# EAGLE design 10S (EAGLE 7.6.0)

## Sheet 1 of 2
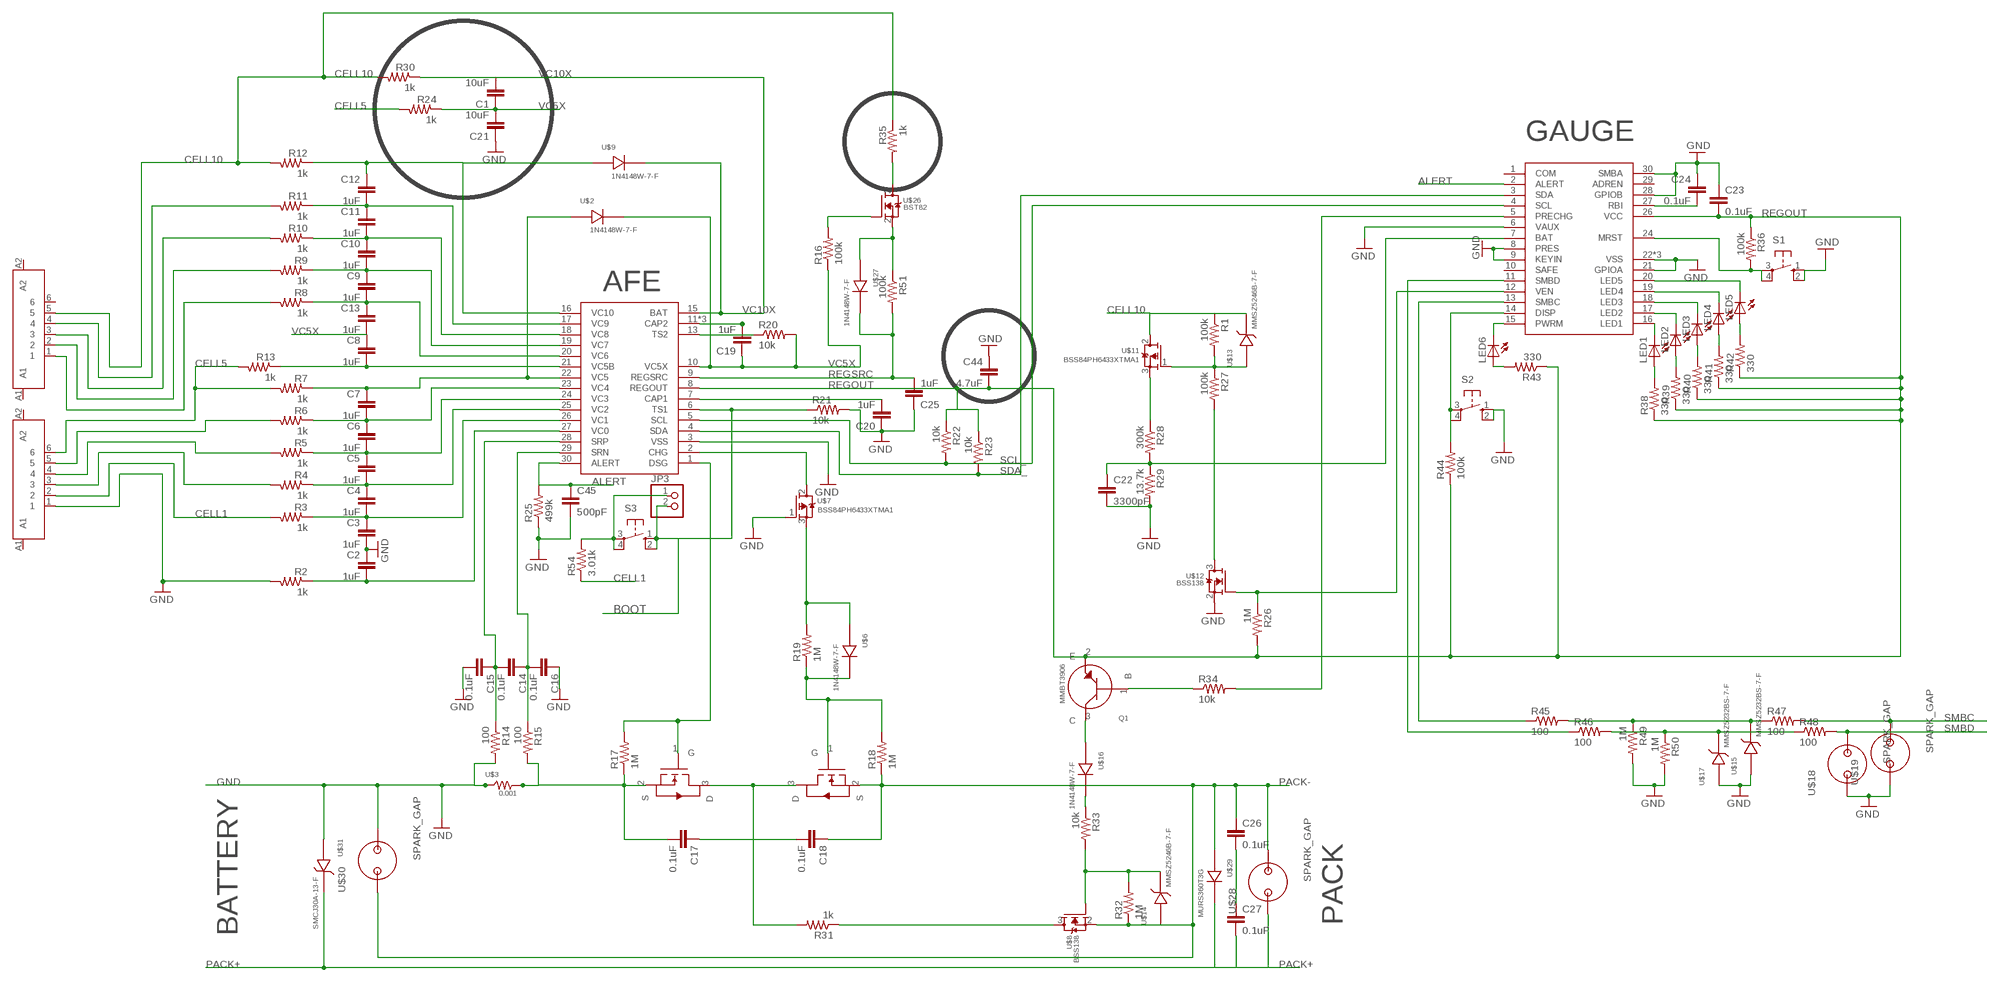
[diagram p0: schematic, sheet 1]

### Parts
C1  10uF  C-EUC1210  [C1210]
C2  1uF  C-EUC0805  [C0805]
C3  1uF  C-EUC0805  [C0805]
C4  1uF  C-EUC0805  [C0805]
C5  1uF  C-EUC0805  [C0805]
C6  1uF  C-EUC0805  [C0805]
C7  1uF  C-EUC0805  [C0805]
C8  1uF  C-EUC0805  [C0805]
C9  1uF  C-EUC0805  [C0805]
C10  1uF  C-EUC0805  [C0805]
C11  1uF  C-EUC0805  [C0805]
C12  1uF  C-EUC0805  [C0805]
C13  1uF  C-EUC0805  [C0805]
C14  0.1uF  C-EUC0805  [C0805]
C15  0.1uF  C-EUC0805  [C0805]
C16  0.1uF  C-EUC0805  [C0805]
C17  0.1uF  C-EUC0805  [C0805]
C18  0.1uF  C-EUC0805  [C0805]
C19  1uF  C-EUC0805  [C0805]
C20  1uF  C-EUC0805  [C0805]
C21  10uF  C-EUC1210  [C1210]
C22  3300pF  C-EUC0402  [C0402]
C23  0.1uF  C-EUC0805  [C0805]
C24  0.1uF  C-EUC0805  [C0805]
C25  1uF  C-EUC0805  [C0805]
C26  0.1uF  C-EUC0805  [C0805]
C27  0.1uF  C-EUC0805  [C0805]
C44  4.7uF  C-EUC0805  [C0805]
C45  500pF  C-EUC0603  [C0603]
JP3  PINHD-1X2  [1X02]
LED1  LEDCHIPLED_0603  [CHIPLED_0603]
LED2  LEDCHIPLED_0603  [CHIPLED_0603]
LED3  LEDCHIPLED_0603  [CHIPLED_0603]
LED4  LEDCHIPLED_0603  [CHIPLED_0603]
LED5  LEDCHIPLED_0603  [CHIPLED_0603]
LED6  LEDCHIPLED_0603  [CHIPLED_0603]
Q1  MMBT3906  [SOT23-3]
R1  100k  R-US_R0805  [R0805]
R2  1k  R-US_R1206  [R1206]
R3  1k  R-US_R1206  [R1206]
R4  1k  R-US_R1206  [R1206]
R5  1k  R-US_R1206  [R1206]
R6  1k  R-US_R1206  [R1206]
R7  1k  R-US_R1206  [R1206]
R8  1k  R-US_R1206  [R1206]
R9  1k  R-US_R1206  [R1206]
R10  1k  R-US_R1206  [R1206]
R11  1k  R-US_R1206  [R1206]
R12  1k  R-US_R1206  [R1206]
R13  1k  R-US_R1206  [R1206]
R14  100  R-US_R0805  [R0805]
R15  100  R-US_R0805  [R0805]
R16  100k  R-US_R0805  [R0805]
R17  1M  R-US_R1206  [R1206]
R18  1M  R-US_R1206  [R1206]
R19  1M  R-US_R1206  [R1206]
R20  10k  R-US_R0805  [R0805]
R21  10k  R-US_R0805  [R0805]
R22  10k  R-US_R0805  [R0805]
R23  10k  R-US_R0805  [R0805]
R24  1k  R-US_R1206  [R1206]
R25  499k  R-US_R0603  [R0603]
R26  1M  R-US_R1206  [R1206]
R27  100k  R-US_R0805  [R0805]
R28  300k  R-US_R0805  [R0805]
R29  13.7k  R-US_R0805  [R0805]
R30  1k  R-US_R1206  [R1206]
R31  1k  R-US_R2512  [R2512]
R32  1M  R-US_R1206  [R1206]
R33  10k  R-US_R0805  [R0805]
R34  10k  R-US_R0805  [R0805]
R35  1k  R-US_R1206  [R1206]
R36  100k  R-US_R0805  [R0805]
R38  330  R-US_R0402  [R0402]
R39  330  R-US_R0402  [R0402]
R40  330  R-US_R0402  [R0402]
R41  330  R-US_R0402  [R0402]
R42  330  R-US_R0402  [R0402]
R43  330  R-US_R0402  [R0402]
R44  100k  R-US_R0402  [R0402]
R45  100  R-US_R0805  [R0805]
R46  100  R-US_R0805  [R0805]
R47  100  R-US_R0805  [R0805]
R48  100  R-US_R0805  [R0805]
R49  1M  R-US_R1206  [R1206]
R50  1M  R-US_R1206  [R1206]
R51  100k  R-US_R0805  [R0805]
R54  3.01k  R-US_R1206  [R1206]
S1  10-XX  [B3F-10XX]
S2  10-XX  [B3F-10XX]
S3  10-XX  [B3F-10XX]
U$1  BQ76930  [SOIC-30]
U$2  1N4148W-7-F  [SOD-123]
U$3  0.001  ERJ-MS6SFM50U  [ERJ-MS6SFM50U]
U$4  AOB290L  [TO-263]
U$5  AOB290L  [TO-263]
U$6  1N4148W-7-F  [SOD-123]
U$7  BSS84PH6433XTMA1  [SOT23-3]
U$8  BSS138  [SOT23-3]
U$9  1N4148W-7-F  [SOD-123]
U$10  BQ78350-R1  [SOIC-30]
U$11  BSS84PH6433XTMA1  [SOT23-3]
U$12  BSS138  [SOT23-3]
U$13  MMSZ5246B-7-F  [SOD-123]
U$14  MMSZ5246B-7-F  [SOD-123]
U$15  MMSZ5232BS-7-F  [SOD-323F]
U$16  1N4148W-7-F  [SOD-123]
U$17  MMSZ5232BS-7-F  [SOD-323F]
U$18  SPARK_GAP  [SPARK_GAP]
U$19  SPARK_GAP  [SPARK_GAP]
U$24  JST_6PIN  [JST_6PIN]
U$26  BST82  [SOT23-3]
U$27  1N4148W-7-F  [SOD-123]
U$28  SPARK_GAP  [SPARK_GAP]
U$29  MURS360T3G  [SMC(DO-214AB)]
U$30  SPARK_GAP  [SPARK_GAP]
U$31  SMCJ30A-13-F  [SMB(DO-214AA)]
U$33  JST_6PIN  [JST_6PIN]

### Nets
ALERT: C45.1 R25.2 U$1.30(ALERT) U$10.2(ALERT)
BOOT: JP3.2 R21.1 S3.1(S) S3.2(S1) U$1.6(TS1)
CELL1: R3.2 R54.1 U$33.2
CELL5: R7.2 R13.2 R24.2 U$33.6
CELL10: R1.1 R12.2 R30.2 R35.1 U$11.2(S) U$13.P$2 U$24.5
GND: C2.1 C3.2 C15.2 C16.1 C20.1 C21.1 C22.2 C23.1 C24.1 C25.1 C44.1 C45.2 R2.2 R14.2 R21.2 R25.1 R29.2 R49.2 R50.2 S1.1(S) S1.2(S1) S2.1(S) S2.2(S1) U$1.3(VSS) U$3.1 U$7.1(G) U$10.6(VAUX) U$10.8(PRES) U$10.9(KEYIN) U$10.21(GPIOA) U$10.22(VSS) U$10.23(VSS) U$10.25(VSS) U$10.28(GPIOB) U$10.30(SMBA) U$12.2(S) U$15.1 U$17.1 U$18.P$1 U$19.P$1 U$30.P$2 U$31.P$1 U$33.1 ; also sheet 2
N$1: C3.1 C4.2 R3.1 U$1.26(VC1)
N$2: C4.1 C5.2 R4.1 U$1.25(VC2)
N$3: C5.1 C6.2 R5.1 U$1.24(VC3)
N$4: C6.1 C7.2 R6.1 U$1.23(VC4)
N$5: C7.1 R7.1 U$1.22(VC5) U$2.P$1
N$6: C8.2 R13.1 U$1.21(VC5B)
N$7: C9.1 C10.2 R9.1 U$1.19(VC7)
N$8: C10.1 C11.2 R10.1 U$1.18(VC8)
N$9: C11.1 C12.2 R11.1 U$1.17(VC9)
N$10: C12.1 R12.1 U$1.16(VC10) U$9.P$1
N$11: R5.2 U$33.4
N$12: C2.2 R2.1 U$1.27(VC0)
N$14: C26.2 C27.1
N$15: R4.2 U$33.3
N$16: R6.2 U$33.5
N$18: R8.2 U$24.1
N$19: R9.2 U$24.2
N$20: R10.2 U$24.3
N$21: R11.2 U$24.4
N$22: R31.1 U$8.3(D)
N$23: C9.2 C13.1 R8.1 U$1.20(VC6)
N$24: R16.2 U$26.1(G)
N$25: C20.2 U$1.7(CAP1)
N$26: C14.1 C16.2 R15.1 U$1.29(SRN)
N$27: JP3.1 R54.2 S3.3(P) S3.4(P1)
N$28: C14.2 C15.1 R14.1 U$1.28(SRP)
N$29: C17.2 R15.2 R17.1 U$3.2 U$4.2(S)
N$31: R31.2 U$4.3(D) U$5.3(D)
N$32: R18.2 R19.1 U$5.1(G) U$6.P$2
N$33: R19.2 U$6.P$1 U$7.3(D)
N$34: U$1.2(CHG) U$7.2(S)
N$35: C17.1 C18.2
N$37: C19.2 U$1.11(CAP2) U$1.12(CAP2) U$1.14(CAP2)
N$38: R20.1 U$1.13(TS2)
N$40: R26.1 U$10.12(VEN) U$12.1(G)
N$41: R27.2 U$12.3(D)
N$43: R1.2 R27.1 U$11.1(G) U$13.P$1
N$44: R28.1 U$11.3(D)
N$45: C22.1 R28.2 R29.1 U$10.7(BAT)
N$46: R32.2 R33.2 U$8.1(G) U$14.P$2
N$47: Q1.3(C) U$16.P$1
N$48: R33.1 U$16.P$2
N$49: Q1.1(B) R34.1
N$50: C24.2 U$10.27(RBI)
N$51: R36.2 S1.3(P) S1.4(P1) U$10.24(MRST)
N$52: LED1.A R38.2
N$53: LED2.A R39.2
N$54: LED3.A R40.2
N$55: LED4.A R41.2
N$56: LED5.A R42.2
N$57: LED1.C U$10.16(LED1)
N$58: LED2.C U$10.17(LED2)
N$59: LED3.C U$10.18(LED3)
N$60: LED4.C U$10.19(LED4)
N$61: LED5.C U$10.20(LED5)
N$62: LED6.A R43.2
N$63: R44.2 S2.3(P) S2.4(P1) U$10.14(DISP)
N$64: LED6.C U$10.15(PWRM)
N$65: R34.2 U$10.5(PRECHG)
N$66: R46.1 U$10.11(SMBD)
N$67: R45.1 U$10.13(SMBC)
N$68: R45.2 R47.1 R49.1 U$15.2
N$69: R46.2 R48.1 R50.1 U$17.2
N$70: R51.1 U$26.2(S) U$27.P$1
N$72: R35.2 U$26.3(D)
N$73: R17.2 U$1.1(DSG) U$4.1(G)
PACK+: C27.2 U$28.P$1 U$29.2 U$31.P$2
PACK-: C18.1 C26.1 R18.1 R32.1 U$5.2(S) U$8.2(S) U$14.P$1 U$28.P$2 U$29.1 U$30.P$1
REGOUT: C23.2 C44.2 Q1.2(E) R22.1 R23.1 R26.2 R36.1 R38.1 R39.1 R40.1 R41.1 R42.1 R43.1 R44.1 U$1.8(REGOUT) U$10.26(VCC) ; also sheet 2
REGSRC: C25.2 R51.2 U$1.9(REGSRC) U$27.P$2
SCL_: R22.2 U$1.5(SCL) U$10.4(SCL)
SDA_: R23.2 U$1.4(SDA) U$10.3(SDA)
SMBC: R47.2 U$19.P$2 ; also sheet 2
SMBD: R48.2 U$18.P$2 ; also sheet 2
VC5X: C1.1 C8.1 C13.2 C19.1 C21.2 R16.1 R20.2 R24.1 U$1.10(VC5X) U$2.P$2
VC10X: C1.2 R30.1 U$1.15(BAT) U$9.P$2
Unconnected: U$10.1(COM) U$10.10(SAFE) U$10.29(ADREN) U$24.6 U$24.A1 U$24.A2 U$33.A1 U$33.A2

### Notes on the sheet
- GAUGE
- AFE
- PACK
- BATTERY

## Sheet 2 of 2
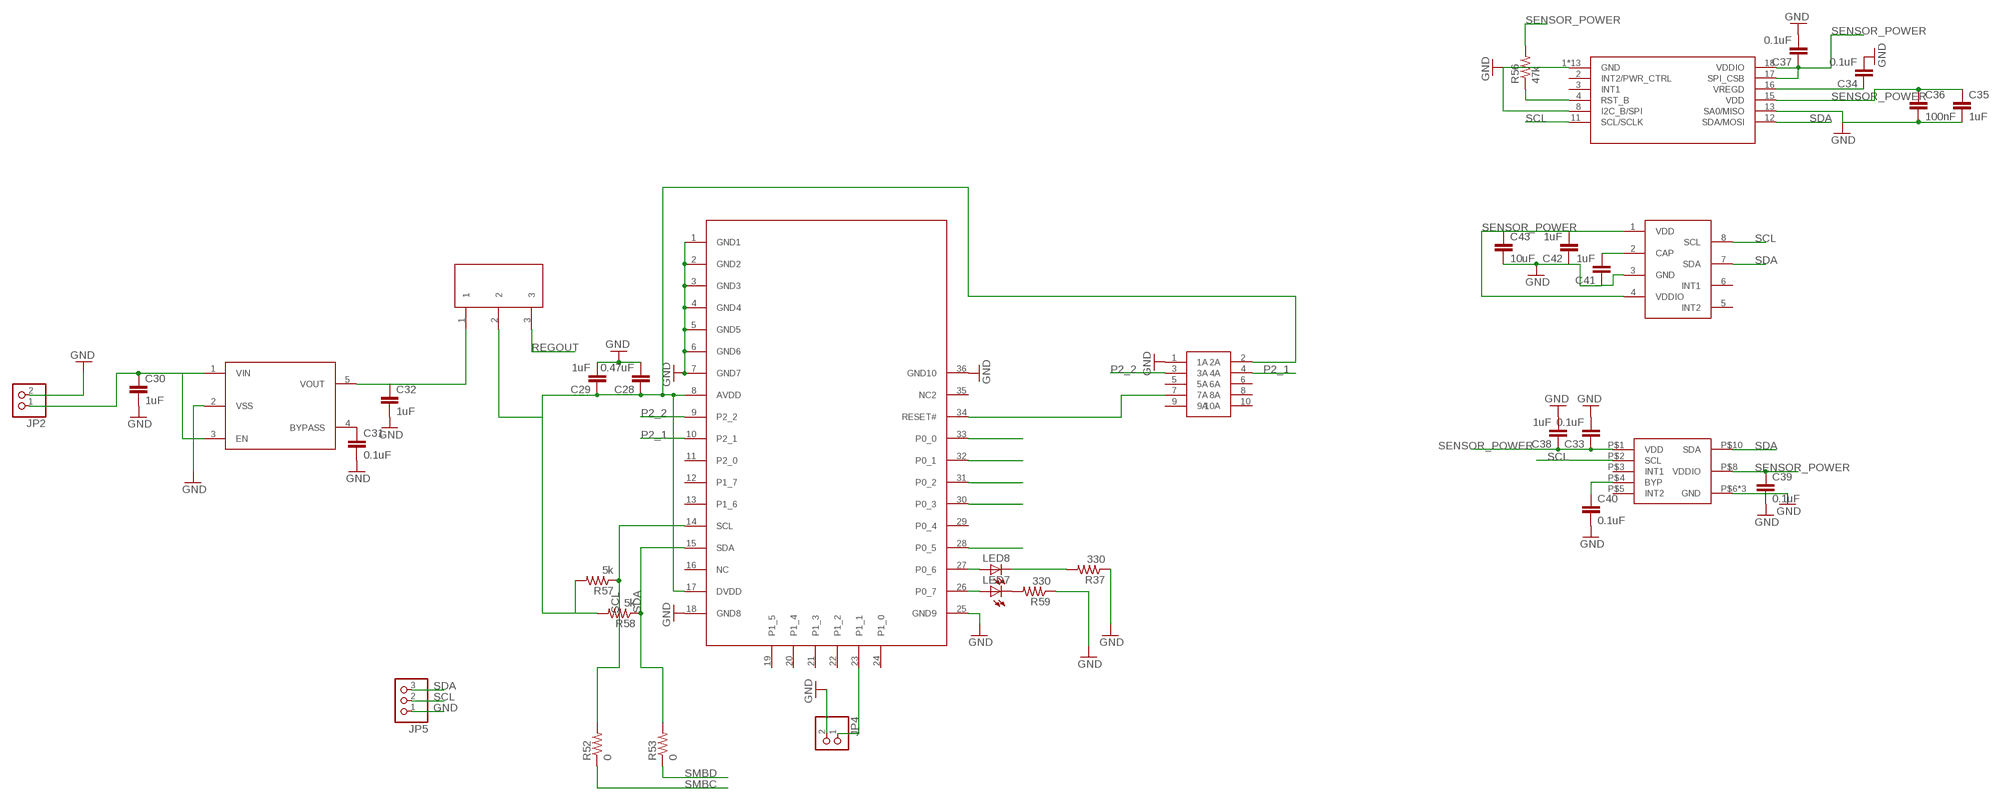
[diagram p1: schematic, sheet 2]

### Parts
C28  0.47uF  C-EUC0402  [C0402]
C29  1uF  C-EUC0402  [C0402]
C30  1uF  C-EUC0402  [C0402]
C31  0.1uF  C-EUC0402  [C0402]
C32  1uF  C-EUC0402  [C0402]
C33  0.1uF  C-EUC0402  [C0402]
C34  0.1uF  C-EUC0402  [C0402]
C35  1uF  C-EUC0402  [C0402]
C36  100nF  C-EUC0402  [C0402]
C37  0.1uF  C-EUC0402  [C0402]
C38  1uF  C-EUC0402  [C0402]
C39  0.1uF  C-EUC0402  [C0402]
C40  0.1uF  C-EUC0402  [C0402]
C41  1uF  C-EUC0402  [C0402]
C42  1uF  C-EUC0402  [C0402]
C43  10uF  C-EUC0603  [C0603]
JP2  PINHD-1X2  [1X02]
JP4  PINHD-1X2  [1X02]
JP5  PINHD-1X3  [1X03]
LED7  LEDCHIP-LED0603  [CHIP-LED0603]
LED8  LEDCHIP-LED0603  [CHIP-LED0603]
R37  330  R-US_R0402  [R0402]
R52  0  R-US_R0201  [R0201]
R53  0  R-US_R0201  [R0201]
R56  47k  R-US_R0402  [R0402]
R57  5k  R-US_R0402  [R0402]
R58  5k  R-US_R0402  [R0402]
R59  330  R-US_R0402  [R0402]
U$20  BLE113  [BLUEGIGA]
U$21  LP3985  [SOT23-5L]
U$22  RIBBON_10POS_MALE  [RIBBON_10POS_MALE]
U$23  SPDT_THRU  [SPDT_THRU]
U$25  MLP3115A2  [MLP3115A2]
U$32  MMA8653FC  [10-DFN2X2]
U$34  FXAS21002  [FXAS21002]

### Nets
CARD2: U$20.32(P0_1)
CD: U$20.33(P0_0)
CLK: U$20.28(P0_5)
GND: C28.2 C29.2 C30.2 C31.2 C32.2 C33.2 C34.2 C35.2 C36.2 C37.2 C38.2 C39.2 C40.2 C41.1 C42.1 C43.2 JP2.2 JP4.2 JP5.1 R37.1 R59.1 U$20.1(GND1) U$20.2(GND2) U$20.3(GND3) U$20.4(GND4) U$20.5(GND5) U$20.6(GND6) U$20.7(GND7) U$20.18(GND8) U$20.25(GND9) U$20.36(GND10) U$21.2(VSS) U$22.1(1A) U$25.3(GND) U$32.P$6(GND) U$32.P$7(GND) U$32.P$9(GND) U$34.1(GND) U$34.5(GND) U$34.6(GND) U$34.7(GND) U$34.8(I2C_B/SPI) U$34.9(GND) U$34.10(GND) U$34.13(SA0/MISO) U$34.14(GND) U$34.19(GND) U$34.20(GND) U$34.21(GND) U$34.22(GND) U$34.23(GND) U$34.24(GND) ; also sheet 1
MISO: U$20.31(P0_2)
MOSI: U$20.30(P0_3)
N$13: LED7.A LED8.A U$20.26(P0_7)
N$17: LED8.C R37.2
N$30: R56.1 U$34.4(RST_B)
N$39: C30.1 JP2.1 U$21.1(VIN) U$21.3(EN)
N$42: JP4.1 U$20.23(P1_1)
N$74: C31.1 U$21.4(BYPASS)
N$75: C32.1 U$21.5(VOUT) U$23.1
N$76: LED7.C R59.2
N$77: U$20.34(RESET#) U$22.7(7A)
N$78: C34.1 U$34.16(VREGD)
N$79: C28.1 C29.1 R57.2 R58.2 U$20.8(AVDD) U$20.17(DVDD) U$22.2(2A) U$23.2
N$81: C41.2 U$25.2(CAP)
N$84: C40.1 U$32.P$4(BYP)
P2_1: U$20.10(P2_1) U$22.4(4A)
P2_2: U$20.9(P2_2) U$22.3(3A)
REGOUT: U$23.3 ; also sheet 1
SCL: JP5.2 R52.2 R57.1 U$20.14(SCL) U$25.8(SCL) U$32.P$2(SCL) U$34.11(SCL/SCLK)
SDA: JP5.3 R53.2 R58.1 U$20.15(SDA) U$25.7(SDA) U$32.P$10(SDA) U$34.12(SDA/MOSI)
SENSOR_POWER: C33.1 C35.1 C36.1 C37.1 C38.1 C39.1 C42.2 C43.1 R56.2 U$25.1(VDD) U$25.4(VDDIO) U$32.P$1(VDD) U$32.P$8(VDDIO) U$34.15(VDD) U$34.17(SPI_CSB) U$34.18(VDDIO)
SMBC: R52.1 ; also sheet 1
SMBD: R53.1 ; also sheet 1
Unconnected: U$20.11(P2_0) U$20.12(P1_7) U$20.13(P1_6) U$20.16(NC) U$20.19(P1_5) U$20.20(P1_4) U$20.21(P1_3) U$20.22(P1_2) U$20.24(P1_0) U$20.27(P0_6) U$20.29(P0_4) U$20.35(NC2) U$22.5(5A) U$22.6(6A) U$22.8(8A) U$22.9(9A) U$22.10(10A) U$25.5(INT2) U$25.6(INT1) U$32.P$3(INT1) U$32.P$5(INT2) U$34.2(INT2/PWR_CTRL) U$34.3(INT1)

## Library data of the parts
C1-C45 = rcl:C-EU: CAPACITOR, European symbol
JP2-JP4 = pinhead:PINHD-1X2: PIN HEADER
JP5 = pinhead:PINHD-1X3: PIN HEADER
LED1-LED8 = adafruit:LED: LED OSRAM: - CHIPLED LG R971, LG N971, LY N971, LG Q971, LY Q971, LO R971, LY R971 LH N974, LH R974 LS Q976, LO Q976, LY Q976 LO Q996 - Hyper CHIPLED LW Q18S LB Q993, LB Q99A, LB R99A - SideLED LS A670, LO A670, LY A670, LG A670, LP A670 LB A673, LV A673, LT A673, LW A673 LH A674 LY A675 LS A676, LA A676, LO A676, LY A676, LW A676 LS A679, LY A679, LG A679 - Hyper Micro SIDELED® LS Y876, LA Y876, LO Y876, LY Y876 LT Y87S - SmartLED LW L88C, LW L88S LB L89C, LB L89S, LG L890 LS L89K, LO L89K, LY L89K LS L896, LA L896, LO L896, LY L896 - TOPLED LS T670, LO T670, LY T670, LG T670, LP T670 LSG T670, LSP T670, LSY T670, LOP T670, LYG T670 LG T671, LOG T671, LSG T671 LB T673, LV T673, LT T673, LW T673 LH T674 LS T676, LA T676, LO T676, LY T676, LB T676, LH T676, LSB T676, LW T676 LB T67C, LV T67C, LT T67C, LS T67K, LO T67K, LY T67K, LW E67C LS E67B, LA E67B, LO E67B, LY E67B, LB E67C, LV E67C, LT E67C LW T67C LS T679, LY T679, LG T679 LS T770, LO T770, LY T770, LG T770, LP T770 LB T773, LV T773, LT T773, LW T773 LH T774 LS E675, LA E675, LY E675, LS T675 LS T776, LA T776, LO T776, LY T776, LB T776 LHGB T686 LT T68C, LB T68C - Hyper Mini TOPLED® LB M676 - Mini TOPLED Santana® LG M470 LS M47K, LO M47K, LY M47K Source: http://www.osram.convergy.de/
Q1 = Charles:MMBT3906: TRANSISTOR PNP 40V 0.2A
R1-R54 R56-R59 = rcl:R-US_: RESISTOR, American symbol
S1-S3 = switch-omron:10-XX: OMRON SWITCH; MPN: B3F-1000; OC_FARNELL: 176432; OC_NEWARK: 36M3542
U$1 = Charles:BQ76930
U$2 U$6 U$9 U$16 U$27 = Charles:1N4148W-7-F: DIODE GENERAL PURPOSE 100V 300MA
U$3 = Charles:ERJ-MS6SFM50U: Shunt Resistor (R2526)
U$4 U$5 = Charles:AOB290L
U$7 U$11 = Charles:BSS84PH6433XTMA1: MOSFET P-Channel 60V 170MA SOT-23
U$8 U$12 = Charles:BSS138: MOSFET N-CH 50V 220MA
U$10 = Charles:BQ78350-R1
U$13 U$14 = Charles:MMSZ5246B-7-F: ZENER DIODE 16V 500MW
U$15 U$17 = Charles:MMSZ5232BS-7-F: ZENER DIODE 5.6V 200MW
U$18 U$19 U$28 U$30 = Charles:SPARK_GAP: Spark Gap 0.2mm ~2kV for ESD Protection
U$20 = James_Updated:BLE113
U$21 = James_Updated:LP3985
U$22 = James_Updated:RIBBON_10POS_MALE
U$23 = James_Updated:SPDT_THRU
U$24 U$33 = James_Updated:JST_6PIN
U$25 = Charles:MLP3115A2: I2C Precision Altimeter
U$26 = Charles:BST82: MOSFET N-CH 50V 220MA
U$29 = Charles:MURS360T3G: Ultrafast Power Rectifier, Diode General Purpose 600V 3A
U$31 = Charles:SMCJ30A-13-F: Zener Diode - 600 Watt Transient Voltage Suppressor - 30VWM 48.4VC - Diode Inc.
U$32 = Charles:MMA8653FC: 3-Axis, 10-bit Digital Accelerometer
U$34 = Charles:FXAS21002: 3-Axis Digital Angular Rate Gyroscope (I2C/SPI)

## Board
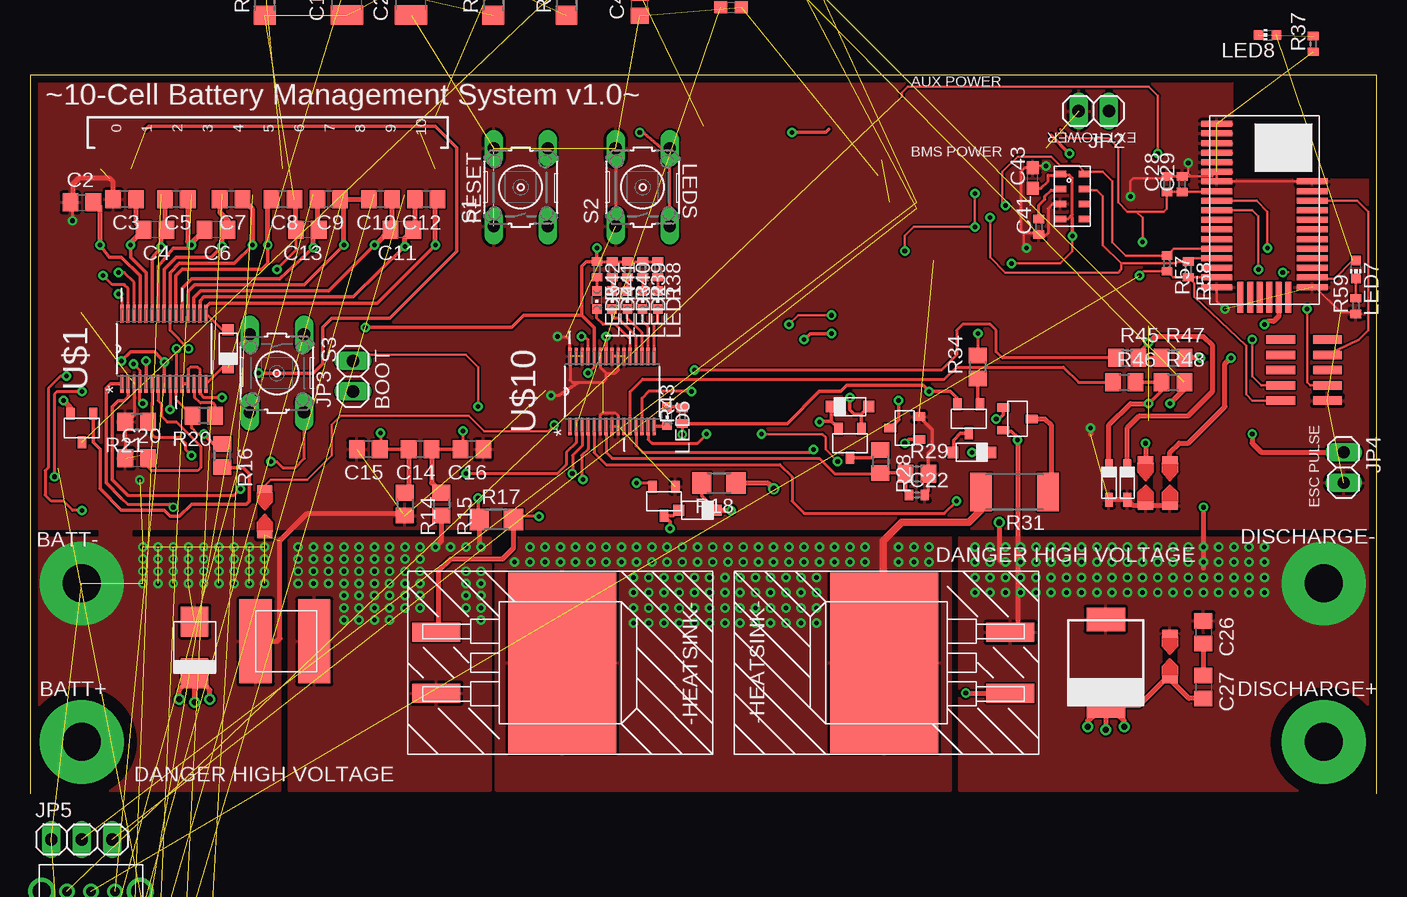
[diagram p2: board, top side]
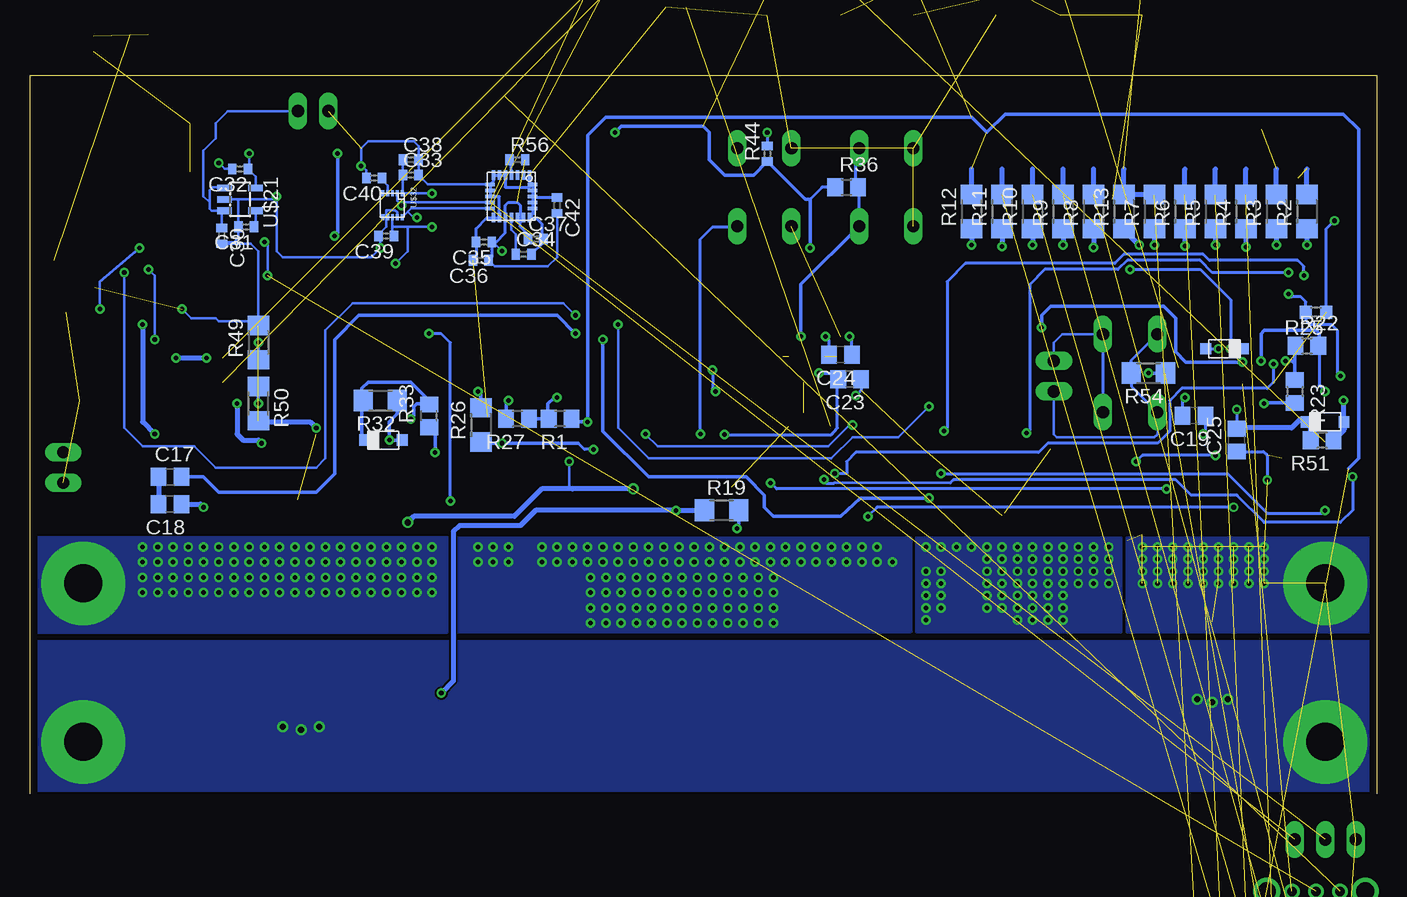
[diagram p3: board, bottom side, seen from below]

Size 112.25 x 59.87 mm. Coordinates in mm from the lower left corner, seen from the top.
Outline: 112.25,0 112.25,59.87 0,59.87 0,0
Copper layers (1*16): Top 0.035mm / dielectric 1.5mm / Bottom 0.035mm
Design rules "DRC_rules": minimum track width 8mil, minimum drill 15mil, track to track 6mil, track to pad 6mil, pad to pad 6mil, via to via 6mil, smd to smd 6mil, copper to edge 25mil, drill to drill 6mil, minimum pad ring 10mil, minimum via ring 8mil, stop-mask expansion 4mil, vias tented up to drill 0mil, thermal gap 10mil
tRestrict: area 100.3,51.3 to 112.5,59.9; area -0.1,-0.1 to 8.8,8.8; area 103.5,-0.1 to 112.4,8.8

### Footprints (pad centres in the part's own frame; a part is rotated, then mirrored left to right if it is on the bottom)
C1210 = smd 1.6 x 2.7: 1 -1.4,0; 2 1.4,0
C0805 = smd 1.3 x 1.5: 1 -0.95,0; 2 0.95,0
C0402 = smd 0.7 x 0.9: 1 -0.65,0; 2 0.65,0
C0603 = smd 1.1 x 1: 1 -0.85,0; 2 0.85,0
1X02 = drill 1.016 long: 1 -1.27,0; 2 1.27,0
1X03 = drill 1.016 long: 1 -2.54,0; 2 0,0; 3 2.54,0
CHIPLED_0603 = smd 0.8 x 0.8: A 0,-0.75; C 0,0.75
CHIP-LED0603 = smd 0.8 x 0.8: A 0,-0.75; C 0,0.75
SOT23-3 = smd 0.7 x 1: 1 -0.95,-1.2; 2 0.95,-1.2; 3 0,1.2
R0805 = smd 1.3 x 1.5: 1 -0.95,0; 2 0.95,0
R1206 = smd 1.6 x 1.803: 1 -1.422,0; 2 1.422,0
R0603 = smd 1 x 1.1: 1 -0.85,0; 2 0.85,0
R2512 = smd 1.8 x 3.2: 1 -2.8,0; 2 2.8,0
R0402 = smd 0.7 x 0.9: 1 -0.65,0; 2 0.65,0
R0201 = smd 0.28 x 0.43: 1 -0.255,0; 2 0.255,0
B3F-10XX = drill 1.016 long: 1 -3.251,2.261; 2 3.251,2.261; 3 -3.251,-2.261; 4 3.251,-2.261
SOIC-30 = smd 1.473 x 0.279: 1 -2.921,3.505; 2 -2.921,2.997; 3 -2.921,2.489; 4 -2.921,2.007; 5 -2.921,1.499; 6 -2.921,0.991; 7 -2.921,0.508; 8 -2.921,0; 9 -2.921,-0.508; 10 -2.921,-0.991; 11 -2.921,-1.499; 12 -2.921,-2.007; 13 -2.921,-2.489; 14 -2.921,-2.997; 15 -2.921,-3.505; 16 2.921,-3.505; 17 2.921,-2.997; 18 2.921,-2.489; 19 2.921,-2.007; 20 2.921,-1.499; 21 2.921,-0.991; 22 2.921,-0.508; 23 2.921,0; 24 2.921,0.508; 25 2.921,0.991; 26 2.921,1.499; 27 2.921,2.007; 28 2.921,2.489; 29 2.921,2.997; 30 2.921,3.505
SOD-123 = smd 0.9 x 0.95: P$1 -1.575,0; P$2 1.575,0
ERJ-MS6SFM50U = smd 2.7 x 7: 1 -2.54,0; 2 2.35,0
TO-263 = smd 1.6 x 4: 1 -2.54,-5.25; 2 2.54,-5.25 | smd 15 x 9: 3 0,5.25
SOD-323F = smd 0.65 x 1.15: 1 0,1.4; 2 0,-1.4
SPARK_GAP = smd 1.27 x 0.635: P$1 0,1.905; P$2 0,-1.905
BLUEGIGA = smd 2.6 x 0.5: 1 -3.975,9.6; 2 -3.975,8.8; 3 -3.975,8; 4 -3.975,7.2; 5 -3.975,6.4; 6 -3.975,5.6; 7 -3.975,4.8; 8 -3.975,4; 9 -3.975,3.2; 10 -3.975,2.4; 11 -3.975,1.6; 12 -3.975,0.8; 13 -3.975,0; 14 -3.975,-0.8; 15 -3.975,-1.6; 16 -3.975,-2.4; 17 -3.975,-3.2; 18 -3.975,-4; 25 3.975,-4; 26 3.975,-3.2; 27 3.975,-2.4; 28 3.975,-1.6; 29 3.975,-0.8; 30 3.975,0; 31 3.975,0.8; 32 3.975,1.6; 33 3.975,2.4; 34 3.975,3.2; 35 3.975,4; 36 3.975,4.8 | smd 0.5 x 2.6: 19 -2,-4.85; 20 -1.2,-4.85; 21 -0.4,-4.85; 22 0.4,-4.85; 23 1.2,-4.85; 24 2,-4.85
SOT23-5L = smd 0.55 x 1.2: 1 -0.95,-1.3; 2 0,-1.3; 3 0.95,-1.3; 4 0.95,1.3; 5 -0.95,1.3
RIBBON_10POS_MALE = smd 0.72 x 2.4: 1 -5.08,-1.95; 2 -5.08,1.95; 3 -3.81,-1.95; 4 -3.81,1.95; 5 -2.54,-1.95; 6 -2.54,1.95; 7 -1.27,-1.95; 8 -1.27,1.95; 9 0,-1.95; 10 0,1.95
SPDT_THRU = drill 0.787: 1 -2.007,0; 2 0,0; 3 2.007,0 | drill 1.499: A1 -4.102,0; A2 4.102,0
JST_6PIN = smd 1.4 x 5.5: 1 -5,-2.775; 2 -3,-2.775; 3 -1,-2.775; 4 1,-2.775; 5 3,-2.775; 6 5,-2.775 | smd 1.5 x 4: A1 -7.35,2.775; A2 7.35,2.775
MLP3115A2 = smd 0.95 x 0.55: 1 -1,1.875; 2 -1,0.625; 3 -1,-0.625; 4 -1,-1.875; 5 1,-1.875; 6 1,-0.625; 7 1,0.625; 8 1,1.875
SMC(DO-214AB) = smd 1.96 x 3.2: 1 -3.6,0; 2 3.6,0
SMB(DO-214AA) = smd 2.5 x 2.3: P$1 -2.15,0; P$2 2.15,0
10-DFN2X2 = smd 0.5 x 0.24: P$1 -1,0.8; P$2 -1,0.4; P$3 -1,0; P$4 -1,-0.4; P$5 -1,-0.8; P$6 1,-0.8; P$7 1,-0.4; P$8 1,0; P$9 1,0.4; P$10 1,0.8
FXAS21002 = smd 0.8 x 0.3: 1 -1.775,1.5; 2 -1.775,1; 3 -1.775,0.5; 4 -1.775,0; 5 -1.775,-0.5; 6 -1.775,-1; 7 -1.775,-1.5; 13 1.775,-1.5; 14 1.775,-1; 15 1.775,-0.5; 16 1.775,0; 17 1.775,0.5; 18 1.775,1; 19 1.775,1.5 | smd 0.3 x 0.8: 8 -1,-1.775; 9 -0.5,-1.775; 10 0,-1.775; 11 0.5,-1.775; 12 1,-1.775; 20 1,1.775; 21 0.5,1.775; 22 0,1.775; 23 -0.5,1.775; 24 -1,1.775

### Placement (x,y rotation side)
C1  26.42,66.29 90 top  (outside the outline)
C2  4.32,49.28 0 top
C3  7.87,49.53 180 top
C4  10.41,46.99 180 top
C5  12.19,49.53 180 top
C6  15.49,46.99 180 top
C7  16.76,49.53 180 top
C8  21.08,49.53 180 top
C9  24.89,49.53 180 top
C10  29.21,49.53 180 top
C11  30.99,46.99 180 top
C12  33.02,49.53 180 top
C13  23.11,46.99 180 top
C14  32.51,28.7 180 top
C15  28.19,28.7 180 top
C16  36.83,28.7 180 top
C17  100.58,26.42 0 bottom
C18  100.58,24.13 180 bottom
C19  15.24,31.5 180 bottom
C20  8.89,27.94 0 top
C21  31.75,66.29 90 top  (outside the outline)
C22  73.91,24.89 0 top
C23  43.94,34.54 180 bottom
C24  44.7,36.58 180 bottom
C25  11.68,29.46 90 bottom
C26  97.79,13.46 270 top
C27  97.79,8.89 270 top
C28  94.74,50.8 90 top
C29  96.01,50.8 90 top
C30  96.27,46.48 270 bottom
C31  94.23,47.24 180 bottom
C32  94.74,52.07 180 bottom
C33  80.52,51.56 0 bottom
C34  71.12,44.96 0 bottom
C35  74.42,45.97 180 bottom
C36  74.68,44.45 180 bottom
C37  70.1,46.23 0 bottom
C38  80.52,52.83 0 bottom
C39  82.55,46.48 180 bottom
C40  83.57,51.31 180 bottom
C41  84.07,47.24 90 top
C42  68.33,49.02 270 bottom
C43  83.57,51.31 90 top
C44  50.8,65.79 90 top  (outside the outline)
C45  58.42,65.53 0 top  (outside the outline)
JP2  88.65,56.9 180 top
JP3  26.92,34.8 90 top
JP4  109.47,27.18 270 top
JP5  4.32,-3.81 0 top  (outside the outline)
LED1  52.32,41.15 180 top
LED2  51.05,41.15 180 top
LED3  49.78,41.15 180 top
LED4  48.51,41.15 180 top
LED5  47.24,41.15 180 top
LED6  53.09,31.5 180 top
LED7  110.49,43.69 180 top
LED8  103.12,63.25 90 top  (outside the outline)
Q1  78.23,31.24 180 top
R1  68.07,31.24 180 bottom
R2  5.84,48.51 90 bottom
R3  8.38,48.51 90 bottom
R4  10.92,48.51 90 bottom
R5  13.46,48.51 90 bottom
R6  16,48.51 90 bottom
R7  18.54,48.51 90 bottom
R8  23.62,48.51 90 bottom
R9  26.16,48.51 90 bottom
R10  28.7,48.51 90 bottom
R11  31.24,48.51 90 bottom
R12  33.78,48.51 90 bottom
R13  21.08,48.51 90 bottom
R14  31.24,24.13 270 top
R15  34.29,24.13 270 top
R16  16,28.19 270 top
R17  38.86,22.86 0 top
R18  57.4,25.91 180 top
R19  54.61,23.62 0 bottom
R20  14.48,31.5 180 top
R21  8.89,30.99 180 top
R22  5.84,37.34 0 bottom
R23  6.86,33.53 270 bottom
R24  19.56,66.29 90 top  (outside the outline)
R25  5.08,40.13 180 bottom
R26  74.68,30.73 90 bottom
R27  71.63,31.24 180 bottom
R28  70.87,27.69 270 top
R29  73.91,26.67 0 top
R30  38.61,66.29 90 top  (outside the outline)
R31  82.04,25.15 180 top
R32  83.06,32.77 180 bottom
R33  78.99,31.5 90 bottom
R34  78.99,35.56 90 top
R35  44.7,66.29 90 top  (outside the outline)
R36  44.2,50.55 0 bottom
R37  106.93,62.48 90 top
R38  52.32,43.69 270 top
R39  51.05,43.69 270 top
R40  49.78,43.69 270 top
R41  48.51,43.69 270 top
R42  47.24,43.69 270 top
R43  54.36,31.5 90 top
R44  50.8,53.34 90 bottom
R45  91.44,36.32 0 top
R46  91.19,34.29 0 top
R47  95.25,36.32 0 top
R48  95.25,34.29 0 top
R49  93.22,37.59 90 bottom
R50  93.22,32.51 270 bottom
R51  4.57,29.46 180 bottom
R52  65.28,67.56 0 top  (outside the outline)
R53  63.75,67.56 0 top  (outside the outline)
R54  19.05,35.05 180 bottom
R56  71.63,52.83 0 bottom
R57  94.74,44.2 270 top
R58  96.52,43.69 270 top
R59  110.49,40.64 90 top
S1  40.89,50.55 90 top
S2  51.05,50.55 90 top
S3  20.57,35.05 270 top
U$1  11.18,37.08 90 top
U$2  12.7,37.08 0 bottom
U$3  21.34,12.7 0 top
U$4  39.12,10.92 270 top
U$5  76.45,10.92 90 top
U$6  55.63,23.62 0 top
U$7  52.83,24.38 180 top
U$8  82.3,31.24 270 top
U$9  16.51,37.08 270 top
U$10  48.51,33.53 90 top
U$11  68.33,29.21 180 top
U$12  72.9,30.48 90 top
U$13  68.33,32.26 180 top
U$14  82.8,29.46 180 bottom
U$15  91.44,25.91 180 top
U$16  78.49,28.45 0 top
U$17  89.92,25.91 180 top
U$18  92.96,25.91 180 top
U$19  95,25.91 180 top
U$20  102.87,46.23 0 top
U$21  94.74,49.53 270 bottom
U$22  106.17,37.85 90 top
U$23  5.08,-8.13 0 top  (outside the outline)
U$24  8.89,-19.3 0 top  (outside the outline)
U$25  86.87,49.78 0 top
U$26  4.32,30.48 180 top
U$27  4.32,30.99 180 bottom
U$28  95,11.43 180 top
U$29  89.66,10.92 270 top
U$30  19.56,23.49 0 top
U$31  13.72,12.19 270 top
U$32  82.04,49.02 270 bottom
U$33  8.89,-29.97 0 top  (outside the outline)
U$34  72.14,49.78 270 bottom

### Tracks (layer width: path | path; a pad name or v marks a point on that pad's centre or on a via)
ALERT  (via drill 0.38)  (1 unrouted)
  Top 0.254: U$10.2 45.52,29.26 44.7,28.45 44.7,27.43 43.94,26.67 v36.32,26.67 | v3.05,34.8 2.54,34.8 1.52,33.78 1.52,27.18 1.27,26.92 1.27,24.89 1.78,24.38 2.79,24.38 3.56,23.62 v4.32,23.62 | U$1.30 7.68,40.01 7.68,41.34 v7.37,41.66
  Bottom 0.254: v7.37,41.66 7.11,41.4 6.35,41.4 5.93,40.98 R25.2 5.93,39.46 5.59,39.12 3.81,39.12 3.3,38.61 3.3,35.05 v3.05,34.8 | v36.32,26.67 12.45,26.67 9.14,23.37 4.57,23.37 v4.32,23.62
BOOT  (via drill 0.38)
  Top 0.203: 104.87,43.47 v104.39,43.43 | v66.8,39.88 64.01,39.88 v63.25,39.12 | v37.34,32.26 37.34,35.56 36.32,36.58 27.43,36.58 JP3.2
  Top 0.254: U$1.6 10.14,31.05 | 10.14,31.05 R21.1 | S3.2 22.86,31.77 22.86,27.94 22.1,27.18 21.08,27.18 20.57,27.69 v20.07,27.69 | 10.14,31.05 10.14,30 10.41,29.72 12.45,29.72 12.95,29.21 12.95,28.7 v13.46,28.19
  Bottom 0.203: v104.39,43.43 104.39,30.48 102.87,28.96 98.55,28.96 96.77,27.18 88.39,27.18 87.63,27.94 87.63,38.61 85.34,40.89 67.82,40.89 v66.8,39.88 | v63.25,39.12 63.25,30.48 60.71,27.94 45.47,27.94 43.69,29.72 39.88,29.72 v37.34,32.26 | S3.1 26.21,38.3 26.92,37.59 JP3.2
  Bottom 0.254: S3.1 S3.2 | v13.46,28.19 19.56,28.19 v20.07,27.69
CELL1  (via drill 0.38)  (2 unrouted)
  Top 0.305: v19.05,35.05 23.62,35.05 24.38,35.81 24.38,38.86 25.15,39.62 29.97,39.62 35.56,45.21 35.56,53.85 33.78,55.63 9.91,55.63 9.65,55.37
  Bottom 0.305: R54.1 v19.05,35.05
  Bottom 0.406: R3.2 8.38,52.07
CELL5  (2 unrouted)
  Bottom 0.406: 21.08,52.07 R13.2 R7.2
CELL10  (via drill 0.38)  (4 unrouted)
  Top 0.305: U$13.P$2 66.75,31.04 | 66.75,31.04 U$11.2 | 66.75,31.04 65.83,31.04 v65.79,30.99
  Bottom 0.305: R1.1 66.87,30.99 v65.79,30.99 65.79,54.86 64.26,56.39 33.78,56.39 32.51,55.12 30.99,56.64 2.79,56.64 1.52,55.37 1.52,27.94 2.35,27.11
  Bottom 0.406: R12.2 33.78,52.07
GND  (via drill 0.38, 3.17 pad 6.99)  (72 unrouted)
  Top 0.203: v84.66,52.32 83.73,52.32 C43.2 | 82.8,46.74 82.8,45.72 v83.06,45.47 | U$20.18 98.89,41.06 v99.57,40.39 | 96.77,51.45 C29.2 C28.2 94.6,51.31 91.95,51.31 91.69,51.05 v91.69,49.78 | 96.77,51.45 98.52,51.45 U$20.6 U$20.7 U$20.36 | v96.52,52.58 96.52,51.7 96.77,51.45 | U$20.25 107.12,42.23 109.22,40.13 110.35,40.13 R59.1
  Top 0.254: U$1.3 8.69,31.48 R21.2 C20.1 | v3.56,47.75 3.56,49.09 C2.1 | S2.2 S2.1 | U$25.3 85.23,49.16 84.84,48.77 84.84,46.74 84.58,46.48 84.19,46.48 C41.1 83.93,46.74 82.8,46.74 82.55,46.99 82.55,51.82 82.89,52.16 C43.2 | U$10.6 47.52,31.52 47.75,31.75 48.77,31.75 49.02,31.5 U$10.9 U$10.8 | U$10.25 47.52,35.54 48.01,35.05 | 48.01,35.05 48.77,35.05 49.02,35.31 U$10.22 U$10.23 | 45.72,34.29 45.21,34.29 45.01,34.49 U$10.30 44.96,36.5 44.96,37.85 44.7,38.1 v43.94,38.1 | 45.72,34.29 47.75,34.29 48.01,34.54 48.01,35.05 | v43.43,33.2 44.04,33.2 45.72,34.29
  Top 0.305: C22.2 74.86,25.19 R29.2 74.86,28.38 75.18,28.7 75.18,30.34 U$12.2
  Top 0.406: C3.2 6.92,50.99 6.6,51.31 4.06,51.31 3.56,50.8 3.56,49.46 C2.1 | U$3.1 20.57,12.7 20.83,12.95 20.83,21.08 23.11,23.37 31.05,23.37 R14.2 | U$19.P$1 U$18.P$1 91.94,24 U$15.1 U$17.1 | v88.39,30.48 88.39,29.97
  Bottom 0.203: U$32.P$9 81.64,48.44 81.86,48.64 82.55,48.64 82.55,48.31 U$32.P$6 U$32.P$7 82.55,47.91 82.55,47.24 83.06,46.74 83.31,46.74 83.2,46.62 C39.2 83.06,46.34 v83.06,45.47 83.82,44.7 91.19,44.7 91.69,45.21 v91.69,49.78 91.95,49.53 U$21.2 95,49.53 94.88,49.42 C31.2 94.88,46.34 95.25,45.97 96.12,45.97 C30.2 93.84,45.83 93.22,45.21 93.22,39.37 | C38.2 C33.2 | C40.2 84.22,51.96 v84.66,52.32 84.66,53.77 84.07,54.36 80.26,54.36 79.87,53.96 C33.2 | U$34.8 79.09,50.78 C33.2 | R49.2 93.22,39.37 | v99.57,40.39 98.81,39.62 96.77,39.62 96.52,39.37 93.22,39.37 | C32.2 96.01,52.07 v96.52,52.58
  Bottom 0.254: R25.1 4.23,47.08 v3.56,47.75 | U$34.1 70.64,51.06 U$34.24 | U$34.24 U$34.23 U$34.22 | U$34.22 U$34.21 U$34.20 70.36,48.28 U$34.19 70.11,48.01 69.6,47.5 69.6,46.37 C37.2 69.45,45.97 C34.2 | U$34.24 70.6,50.55 72.64,50.55 U$34.5 U$34.6 U$34.7 73.64,51.06 U$34.8 U$34.9 U$34.10 73.15,49.78 73.14,49.77 U$34.14 U$34.13 74.17,48.01 75.07,47.1 C35.2 75.07,44.7 C36.2 | C42.1 70.25,49.67 U$34.22 | C23.1 42.99,33.64 v43.43,33.2 | C24.1 43.75,37.91 v43.94,38.1 | C25.1 9.46,28.51 9.14,28.19 v9.14,26.16
  Bottom 0.406: R50.2 93.22,30.99 88.9,30.99 v88.39,30.48 | R2.2 5.84,52.07
  other vias: 4.32,17.53 9.4,20.57 10.67,20.57 11.94,20.57 13.21,20.57 14.48,20.57 15.75,20.57 17.02,20.57 18.29,20.57 19.56,20.57 9.4,19.56 10.67,19.56 11.94,19.56 13.21,19.56 13.21,18.54 11.94,18.54 10.67,18.54 9.4,18.54 9.4,17.53 10.67,17.53 11.94,17.53 13.21,17.53 14.48,19.56 14.48,18.54 14.48,17.53 15.75,19.56 15.75,18.54 15.75,17.53 17.02,19.56 17.02,18.54 17.02,17.53 18.29,19.56 18.29,18.54 18.29,17.53 19.56,19.56 19.56,18.54 19.56,17.53
  pour Top: 20.83,0.25 0.25,0.25 0.25,21.34 5.84,21.34 5.84,22.1 0,22.1 0,59.94 112.27,59.94 112.27,22.1 8.38,22.1 8.38,21.34 20.83,21.34
  pour Bottom: 0.25,13.46 20.83,13.46 20.83,21.34 0.25,21.34
N$1  (via drill 0.38)
  Top 0.305: U$1.26 9.68,43.41 8.38,44.7 v8.38,45.72
  Top 0.406: v8.38,45.72 8.38,45.91 C4.2 8.82,47.63 C3.1
  Bottom 0.406: R3.1 v8.38,45.72
N$2  (via drill 0.38)
  Top 0.305: U$1.25 10.18,44.65 v10.92,45.57
  Top 0.406: v10.92,45.57 10.92,46.55 C4.1 11.24,47.11 C5.2
  Bottom 0.406: R4.1 v10.92,45.57
N$3  (via drill 0.38)
  Top 0.305: U$1.24 10.67,43.94 11.94,45.47 13.21,45.47 v13.46,45.72
  Top 0.406: C6.2 13.46,45.91 v13.46,45.72 13.14,46.04 C5.1
  Bottom 0.406: R5.1 v13.46,45.72
N$4  (via drill 0.38)
  Top 0.305: U$1.23 11.18,43.69 12.19,44.7 15.09,44.7 v16,45.64
  Top 0.406: v16,45.64 16,46.55 C6.1 16.51,47.06 16.51,47.75 15.81,48.45 C7.2
  Bottom 0.406: R6.1 v16,45.64
N$5  (via drill 0.38)
  Top 0.254: v13.21,37.08 11.68,38.61 U$1.22
  Top 0.305: U$1.22 11.68,43.43 12.45,44.2 17.02,44.2 v18.54,45.72
  Top 0.406: v18.54,45.72 18.54,48.7 C7.1
  Bottom 0.254: U$2.P$1 v13.21,37.08
  Bottom 0.406: R7.1 v18.54,45.72
N$6  (via drill 0.38)
  Top 0.305: U$1.21 12.17,43.16 12.7,43.69 19.3,43.69 19.81,44.2 v19.81,45.72
  Top 0.406: 20.07,49.46 C8.2 19.81,49.21 v19.81,45.72
  Bottom 0.406: R13.1 21.08,46.99 v19.81,45.72
N$7  (via drill 0.38)
  Top 0.305: U$1.19 13.18,41.89 13.72,42.42 22.86,42.42 v26.16,45.72
  Top 0.406: v26.16,45.72 26.16,49.21 C9.1 C10.2
  Bottom 0.406: R9.1 v26.16,45.72
N$8  (via drill 0.38)
  Top 0.305: U$1.18 13.66,41.35 14.22,41.91 24.89,41.91 v28.7,45.72
  Top 0.406: v28.7,45.72 28.77,45.72 C11.2 30.16,47.11 C10.1
  Bottom 0.406: R10.1 v28.7,45.72
N$9  (via drill 0.38)
  Top 0.305: U$1.17 14.17,41.1 14.48,41.4 26.92,41.4 v31.24,45.62
  Top 0.406: C12.2 32.07,47.12 C11.1 31.24,46.29 v31.24,45.62
  Bottom 0.406: R11.1 v31.24,45.62
N$10  (via drill 0.38)
  Top 0.254: U$9.P$1 16,38.68 U$1.16
  Top 0.305: U$1.16 14.68,40.59 14.99,40.89 28.96,40.89 v33.78,45.72
  Top 0.406: v33.78,45.72 33.78,49.34 C12.1
  Bottom 0.406: R12.1 v33.78,45.72
N$11  (1 unrouted)
  Bottom 0.406: R5.2 13.46,52.07
N$12  (via drill 0.38)
  Top 0.305: U$1.27 9.17,43.16 7.62,44.7 6.6,44.7 v5.84,45.72
  Top 0.406: v5.84,45.72 5.84,48.96 C2.2
  Bottom 0.406: R2.1 v5.84,45.72
N$13  (1 unrouted)
  Top 0.203: LED7.A 110.22,44.44 108.71,42.93 106.95,42.93 U$20.26
N$14
  Top 0.406: C26.2 C27.1
N$15  (1 unrouted)
  Bottom 0.406: R4.2 10.92,52.07
N$16  (1 unrouted)
  Bottom 0.406: R6.2 16,52.07
N$17  (1 unrouted)
N$18  (1 unrouted)
  Bottom 0.406: R8.2 23.62,52.07
N$19  (1 unrouted)
  Bottom 0.406: R9.2 26.16,52.07
N$20  (1 unrouted)
  Bottom 0.406: R10.2 28.7,52.07
N$21  (1 unrouted)
  Bottom 0.406: R11.2 31.24,52.07
N$22
  Top 0.406: U$8.3 84.58,31.24 85.09,30.73 85.09,25.39 R31.1
N$23  (via drill 0.38)
  Top 0.305: U$1.20 12.68,42.14 13.46,42.93 20.83,42.93 v23.62,45.52
  Top 0.406: v23.62,45.52 23.62,46.55 C13.1 23.94,47.11 C9.2
  Bottom 0.406: R8.1 v23.62,45.52
N$24
  Top 0.305: U$26.1 5.27,29.28 5.84,28.7 5.84,25.4 7.62,23.62 11.18,23.62 11.68,23.11 12.45,23.11 13.46,24.13 18.03,24.13 18.29,24.38 18.29,26.67 17.78,27.18 16.07,27.18 R16.2
N$25
  Top 0.254: U$1.7 10.67,32.77 10.92,32.51 10.92,31.5 11.43,30.99 12.19,30.99 14.22,28.96 14.22,27.18 13.97,26.92 10.16,26.92 9.91,27.18 9.91,27.87 C20.2
N$26  (via drill 0.38)
  Top 0.254: U$1.29 8.18,42.11 7.87,42.42 6.86,42.42 v6.1,43.18 | v36.07,30.23 36.07,28.89 C16.2
  Top 0.305: C14.1 C16.2
  Top 0.406: C14.1 33.46,25.91 R15.1
  Bottom 0.254: v6.1,43.18 6.1,43.94 6.6,44.45 13.97,44.45 14.48,44.96 21.08,44.96 21.84,44.2 34.29,44.2 35.81,42.67 35.81,30.48 v36.07,30.23
N$27
  Bottom 0.203: JP3.1 26.92,29.97 26.67,29.72 18.54,29.72 18.29,29.97 18.29,31.77 S3.4
  Bottom 0.254: S3.3 20.47,36.15 R54.2 20.47,33.96 S3.4
N$28  (via drill 0.38)
  Top 0.254: U$1.28 8.69,42.62 7.87,43.43 v7.37,43.43 | v29.21,30.05 29.21,28.77 C15.1
  Top 0.305: C15.1 C14.2
  Top 0.406: C14.2 31.56,25.4 R14.1
  Bottom 0.254: v7.37,43.43 13.72,43.43 14.73,44.45 20.83,44.45 21.59,43.69 27.69,43.69 28.96,42.42 28.96,30.3 v29.21,30.05
N$29  (via drill 0.38)
  Top 0.305: v66.8,38.35 65.02,38.35 v64.52,37.85 | v37.34,24.64 37.34,22.96
  Top 0.406: 37.34,22.96 R17.1 37.44,20.73 v37.59,20.57 | R15.2 34.29,21.08 v33.78,20.57
  Bottom 0.305: C17.2 97.79,26.42 96.52,25.15 88.39,25.15 86.87,26.67 86.87,37.85 84.84,39.88 68.33,39.88 v66.8,38.35 | v64.52,37.85 64.52,30.23 60.71,26.42 52.58,26.42 51.05,24.89 51.05,23.88 50.29,23.11 44.7,23.11 43.08,24.64 v37.34,24.64
  other vias: 22.35,20.57 23.62,20.57 24.89,20.57 26.16,20.57 27.43,20.57 28.7,20.57 29.97,20.57 31.24,20.57 32.51,20.57 35.05,20.57 36.32,20.57 22.35,19.56 23.62,19.56 24.89,19.56 26.16,19.56 26.16,18.54 24.89,18.54 23.62,18.54 22.35,18.54 22.35,17.53 23.62,17.53 24.89,17.53 26.16,17.53 26.16,16.51 26.16,15.49 26.16,14.48 27.43,19.56 27.43,18.54 27.43,17.53 27.43,16.51 27.43,15.49 27.43,14.48 28.7,19.56 28.7,18.54 28.7,17.53 28.7,16.51 28.7,15.49 28.7,14.48 29.97,19.56 29.97,18.54 29.97,17.53 29.97,16.51 29.97,15.49 29.97,14.48 31.24,19.56 31.24,18.54 31.24,17.53 31.24,16.51 31.24,15.49 32.51,19.56 32.51,18.54 32.51,17.53 32.51,16.51 32.51,15.49 36.32,18.54 36.32,17.53 36.32,16.51 36.32,15.49 37.59,18.54 37.59,17.53 37.59,16.51 37.59,15.49 37.59,14.48
  pour Top: 21.59,21.34 38.35,21.34 38.35,0.25 21.59,0.25
  pour Bottom: 21.34,13.46 38.35,13.46 38.35,21.34 21.34,21.34
N$30
  Bottom 0.254: U$34.4 72.14,52.69 R56.1
N$31  (via drill 0.38)
  Top 0.635: R31.2 79.24,23.62 78.23,22.61 72.64,22.61 71.12,21.08 71.12,11.01 U$5.3
  other vias: 50.29,14.22 51.56,14.22 52.83,14.22 54.1,14.22 55.37,14.22 56.64,14.22 57.91,14.22 59.18,14.22 60.45,14.22 61.72,14.22 62.99,14.22 64.26,14.22 65.53,14.22 50.29,15.49 51.56,15.49 52.83,15.49 54.1,15.49 55.37,15.49 56.64,15.49 57.91,15.49 59.18,15.49 60.45,15.49 61.72,15.49 62.99,15.49 64.26,15.49 65.53,15.49 50.29,16.76 51.56,16.76 52.83,16.76 54.1,16.76 55.37,16.76 56.64,16.76 57.91,16.76 59.18,16.76 60.45,16.76 61.72,16.76 62.99,16.76 64.26,16.76 65.53,16.76 50.29,18.03 51.56,18.03 52.83,18.03 54.1,18.03 55.37,18.03 56.64,18.03 57.91,18.03 59.18,18.03 60.45,18.03 61.72,18.03 62.99,18.03 64.26,18.03 65.53,18.03 56.9,19.3 58.17,19.3 59.44,19.3 60.71,19.3 61.98,19.3 63.25,19.3 64.52,19.3 65.79,19.3 67.06,19.3 68.33,19.3 69.6,19.3 58.17,20.57 59.44,20.57 60.71,20.57 61.98,20.57 63.25,20.57 64.52,20.57 65.79,20.57 67.06,20.57 68.33,20.57 69.6,20.57 41.66,20.57 42.93,20.57 44.2,20.57 45.47,20.57 46.74,20.57 48.01,20.57 49.28,20.57 50.55,20.57 51.82,20.57 53.09,20.57 54.36,20.57 55.63,20.57 56.9,20.57 40.39,19.3 41.66,19.3 42.93,19.3 44.2,19.3 45.47,19.3 46.74,19.3 48.01,19.3 49.28,19.3 50.55,19.3 51.82,19.3 53.09,19.3 54.36,19.3 55.63,19.3 72.39,19.3 73.66,19.3 72.39,20.57 73.66,20.57 74.93,19.3 74.93,20.57
  pour Top: 38.86,0.25 38.86,21.34 76.71,21.34 76.71,0.25
  pour Bottom: 38.86,13.46 76.71,13.46 76.71,21.34 38.86,21.34
N$32  (via drill 0.38)
  Top 0.305: R18.2 55.98,24.84 U$6.P$2
  Top 0.406: U$6.P$2 v58.42,23.62 | v77.98,8.38 U$5.1
  Bottom 0.406: R19.1 v58.42,23.62 70.1,23.62 71.37,22.35 76.45,22.35 76.96,21.84 76.96,9.4 v77.98,8.38
N$33  (via drill 0.38)
  Top 0.305: U$6.P$1 53.61,23.18 U$7.3 53.34,22.68 v53.34,22.1
  Bottom 0.305: R19.2 53.19,22.25 v53.34,22.1
N$34  (via drill 0.38)
  Top 0.254: 8.13,24.89 17.02,24.89 v17.53,25.4 | v50.55,25.91 51.56,25.91
  Top 0.305: U$1.2 8.18,33.07 7.87,32.77 7.37,32.77 6.86,32.26 6.86,26.16 8.13,24.89 | 51.56,25.91 U$7.2
  Bottom 0.254: v17.53,25.4 50.04,25.4 v50.55,25.91
N$35
  Bottom 0.406: C17.1 C18.2
N$37  (via drill 0.38)
  Top 0.254: v16,33.02 14.48,33.02 14.17,33.33 U$1.14 14.17,35.36 13.97,35.56 13.36,35.56 13.18,35.38 U$1.12
  Top 0.305: U$1.11 U$1.12
  Bottom 0.254: C19.2 16.19,32.83 v16,33.02
N$38
  Top 0.254: R20.1 15.43,32.32 15.21,32.56 14.2,32.56 13.72,33.02 13.72,34.11 U$1.13
N$39
  Bottom 0.203: C30.1 96.27,48.36 U$21.3 97.09,48.58 97.28,48.77 97.28,49.28 | 97.28,49.28 97.28,50.29 97.03,50.55 96.11,50.55 U$21.1 | 97.28,49.28 97.79,49.78 97.79,53.59 96.77,54.61 96.77,55.88 95.76,56.9 JP2.1
N$40  (via drill 0.38)
  Top 0.254: U$10.12 50.52,28.98 51.05,28.45 65.02,28.45 v65.28,28.7
  Top 0.305: U$12.1 73.22,29.53 v72.9,29.21
  Bottom 0.254: v65.28,28.7 66.04,28.7 66.55,29.21
  Bottom 0.305: R26.1 74.57,29.21 v72.9,29.21 66.55,29.21
N$41  (via drill 0.38)
  Top 0.305: v72.39,32.77 72.39,31.17 U$12.3
  Bottom 0.305: R27.2 72.58,32.58 v72.39,32.77
N$42  (via drill 0.38)
  Top 0.406: U$20.23 104.07,39.81 103.63,39.37 103.12,39.37 v102.87,39.12 | v101.85,29.97 101.85,29.21 102.62,28.45 JP4.1
  Bottom 0.406: v102.87,39.12 102.87,30.99 v101.85,29.97
N$43  (via drill 0.38)
  Top 0.305: U$11.1 69.28,31.63 | 69.28,31.63 U$13.P$1 | 69.28,31.63 68.7,31.63 68.33,32 v68.33,33.02
  Bottom 0.305: R27.1 R1.2 69.09,31.31 69.09,32.51 68.58,33.02 v68.33,33.02
N$44
  Top 0.305: U$11.3 70.24,28.01 R28.1
N$45
  Top 0.254: U$10.7 48.01,28.45 48.51,27.94 65.79,27.94 67.06,26.67 70.8,26.67 R28.2
  Top 0.305: C22.1 72.96,25.19 R29.1 72.9,26.74 R28.2
N$46  (via drill 0.38)
  Top 0.305: U$8.1 81.1,31.57 80.77,31.24 v80.52,31.24
  Bottom 0.305: 84.58,32.61 84.58,33.78 84.07,34.29 80.52,34.29 78.99,32.77 R33.2 79.06,32.51 80.01,32.51 80.26,32.26 80.26,31.5 v80.52,31.24 | 84.58,32.61 R32.2 | 84.58,32.61 84.58,29.67 U$14.P$2
N$47
  Top 0.305: Q1.3 77.54,30.04 76.96,29.46 76.96,28.5 U$16.P$1
N$48  (via drill 0.38)
  Top 0.305: U$16.P$2 v78.49,28.45
  Bottom 0.305: v78.49,28.45 78.49,30.04 R33.1
N$49
  Top 0.305: R34.1 78.99,32.63 Q1.1
N$50  (via drill 0.38)
  Top 0.254: v45.97,38.1 46.23,38.1 46.48,37.85 46.48,36.47 U$10.27
  Bottom 0.254: C24.2 45.65,37.78 v45.97,38.1
N$51  (via drill 0.38)
  Top 0.305: v48.01,38.1 U$10.24
  Bottom 0.254: S1.3 43.16,50.46 R36.2 43.43,50.55 43.43,53.52 S1.4
  Bottom 0.305: S1.3 48.01,42.44 v48.01,38.1
N$52
  Top 0.254: R38.2 LED1.A
N$53
  Top 0.254: R39.2 LED2.A
N$54
  Top 0.254: R40.2 LED3.A
N$55
  Top 0.254: R41.2 LED4.A
N$56
  Top 0.254: R42.2 LED5.A
N$57
  Top 0.254: U$10.16 52.02,39.07 52.32,39.37 LED1.C
N$58
  Top 0.254: U$10.17 51.51,38.91 51.05,39.37 LED2.C
N$59
  Top 0.254: U$10.18 51,38.41 49.78,39.62 LED3.C
N$60
  Top 0.254: U$10.19 50.52,38.12 49.02,39.62 48.77,39.62 48.51,39.88 LED4.C
N$61
  Top 0.254: U$10.20 50.01,37.87 48.77,39.12 47.75,39.12 47.24,39.62 LED5.C
N$62
  Top 0.305: LED6.A 54.26,32.25 R43.2
N$63  (via drill 0.38)
  Top 0.254: S2.3 S2.4 52.63,53.8 51.16,55.09 v50.81,55.09 | U$10.14 51.51,29.52 51.82,29.21 55.63,29.21 v56.39,29.97
  Bottom 0.254: v50.81,55.09 R44.2 | v56.39,29.97 56.39,46.23 55.37,47.24 53.37,47.24 S2.3
N$64
  Top 0.305: U$10.15 52.95,30.61 LED6.C
N$65  (via drill 0.38)
  Top 0.254: U$10.5 47.02,28.42 48.01,27.43 62.48,27.43 63.5,26.42 63.5,24.38 64.52,23.37 76.2,23.37 v77.22,24.38 | v78.99,38.35 R34.2
  Bottom 0.254: v77.22,24.38 77.22,37.59 77.98,38.35 v78.99,38.35
N$66
  Top 0.254: U$10.11 50.01,33.5 51.05,34.54 76.2,34.54 77.22,35.56 86.11,35.56 87.38,34.29 R46.1
N$67  (via drill 0.38)
  Top 0.254: U$10.13 51,32.97 51.56,33.53 v55.12,33.53 | R45.1 81.03,36.32 80.52,36.83 80.52,38.61 80.01,39.12 77.72,39.12 77.22,38.61 77.22,36.58 75.95,35.31 v55.37,35.31
  Bottom 0.254: v55.37,35.31 55.37,33.78 v55.12,33.53
N$68  (via drill 0.38)
  Top 0.305: R47.1 R45.2 92.39,36.76 v93.22,37.59
  Top 0.406: U$15.2 91.44,30.48 92.46,31.5 96.52,31.5 98.55,33.53 98.55,37.34 97.79,38.1 93.73,38.1 v93.22,37.59
  Bottom 0.305: v93.22,37.59 R49.1
N$69  (via drill 0.38)
  Top 0.305: R46.2 R48.1 94.3,33.59 v93.22,32.51
  Top 0.406: U$17.2 89.92,30.73 91.69,32.51 v93.22,32.51
  Bottom 0.305: v93.22,32.51 R50.1
N$70  (via drill 0.38)
  Top 0.406: U$26.2 3.37,32.19 v2.79,32.77
  Bottom 0.406: R51.1 2.74,30.34 U$27.P$1 2.79,31.29 v2.79,32.77
N$72  (1 unrouted)
N$73  (via drill 0.38)
  Top 0.254: 7.62,24.64 8.13,24.13 11.68,24.13 v11.94,23.88 | v42.42,23.11 40.54,23.11 R17.2 | 34.04,13.63 U$4.1
  Top 0.305: U$1.1 6.73,34.16 6.35,33.78 6.35,25.91 7.62,24.64
  Top 0.406: R17.2 40.28,20.47 39.37,19.56 35.05,19.56 34.04,18.54 34.04,13.63
  Bottom 0.254: v11.94,23.88 41.66,23.88 v42.42,23.11
N$74
  Bottom 0.203: U$21.4 93.44,47.39 C31.1
N$75  (via drill 0.38)  (1 unrouted)
  Top 0.203: v93.98,53.34 93.98,58.17 93.22,58.93 73.15,58.93 72.64,58.42 72.64,58.1
  Bottom 0.203: U$21.5 93.44,51.42 C32.1 93.98,52.18 v93.98,53.34
N$76
  Top 0.203: LED7.C R59.2
N$77
  Top 0.203: U$20.34 110.59,49.43 111.51,48.51 111.51,38.61 110.74,37.85 U$22.7
N$78
  Bottom 0.203: C34.1 71.77,46.62 72.14,46.99 U$34.16
N$79  (via drill 0.38)  (1 unrouted)
  Top 0.203: R58.2 95.25,43.04 R57.2 92.82,43.55 v92.46,43.18 | R58.2 98.88,43.04 U$20.17 | U$22.2 101.85,32.77 101.35,33.27 101.35,37.34 97.03,41.4 97.03,42.53 R58.2 | U$20.8 98.82,50.15 C29.1 C28.1 94.74,48.77 94.49,48.51 92.2,48.51 | 85.85,55.37 86.61,54.61 89.92,54.61 90.68,53.85 90.68,49.28 91.44,48.51 92.2,48.51 | v92.71,45.97 92.71,48.01 92.2,48.51
  Bottom 0.203: v92.46,43.18 92.46,45.72 v92.71,45.97
N$81
  Top 0.254: C41.2 84.07,49.02 84.58,49.53 84.58,49.78 85.09,50.29 85.75,50.29 U$25.2
N$84
  Bottom 0.203: C40.1 82.92,51.17 82.42,50.67 82.42,50.04 U$32.P$4
P2_1  (via drill 0.38)
  Top 0.203: U$22.4 102.62,34.04 101.85,34.8 v101.85,37.85 | v102.36,43.69 102.36,48.13 101.85,48.64 98.91,48.64 U$20.10
  Bottom 0.203: v101.85,37.85 101.85,43.18 v102.36,43.69
P2_2  (via drill 0.38)
  Top 0.203: U$20.9 102.21,49.43 103.12,48.51 v103.12,45.47 | U$22.3 106.68,34.04 106.43,34.29 v106.43,40.39
  Bottom 0.203: v106.43,40.39 106.43,42.67 v103.12,45.47
PACK+  (via drill 0.51, 3.17 pad 6.99)
  Top 0.406: v13.72,7.62 U$31.P$2 | U$31.P$2 13.72,10.16 | v14.99,7.87 14.99,8.64 14.38,9.36 | 14.38,9.36 13.72,10.16 | v12.45,7.87 12.45,8.64 13.72,10.16 | C27.2 96.58,7.94 U$28.P$1 94.61,9.52 92.46,7.37 89.66,7.37 | 89.66,7.37 88.65,7.37 | 89.66,7.87 89.66,7.37 | v89.66,5.33 U$29.2 89.66,7.37 | v91.19,5.59 91.19,6.1 89.92,7.11 | v88.14,5.59 88.14,6.1 89.41,7.11 | U$31.P$2 14.38,9.36
  other vias: 4.32,4.32 107.82,4.32
  pour Bottom: 0.25,0.25 112.27,0.25 112.27,12.7 0.25,12.7
PACK-  (via drill 0.38, 0.51, 3.17 pad 6.99)
  Top 0.203: U$30.P$1 19.56,25.65 20.07,26.16 23.11,26.16 25.15,28.19 25.15,30.73 25.91,31.5 36.58,31.5 37.85,30.23 43.18,30.23 v43.69,30.73 | v60.96,29.97 66.04,29.97 66.29,29.72 66.29,28.7 v67.31,27.69
  Top 0.305: v82.3,29.46 82.3,29.72 81.79,30.23 81.16,30.23 U$8.2
  Top 0.406: v82.3,29.46 82.3,14.05 U$5.2 | R18.1 61.47,25.91 v61.98,25.4 | v80.77,22.61 80.77,19.56 81.03,19.3 | v97.79,23.88 97.79,18.8
  Bottom 0.203: v43.69,30.73 43.94,30.73 45.72,28.96 59.94,28.96 v60.96,29.97 | v67.31,27.69 67.31,25.65 67.06,25.4
  Bottom 0.305: R32.1 81.64,31.65 82.3,30.99 v82.3,29.46 U$14.P$1
  Bottom 0.406: v61.98,25.4 67.06,25.4 69.6,25.4 71.88,23.11 80.26,23.11 v80.77,22.61 | C18.1 98.04,24.13 v97.79,23.88
  other vias: 107.82,17.53 93.98,19.3 95.25,19.3 96.52,19.3 97.79,19.3 99.06,19.3 100.33,19.3 101.6,19.3 102.87,19.3 95.25,20.57 96.52,20.57 97.79,20.57 99.06,20.57 100.33,20.57 101.6,20.57 102.87,20.57 78.74,20.57 80.01,20.57 81.28,20.57 82.55,20.57 83.82,20.57 85.09,20.57 86.36,20.57 87.63,20.57 88.9,20.57 90.17,20.57 91.44,20.57 92.71,20.57 93.98,20.57 78.74,19.3 80.01,19.3 81.28,19.3 82.55,19.3 83.82,19.3 85.09,19.3 86.36,19.3 87.63,19.3 88.9,19.3 90.17,19.3 91.44,19.3 92.71,19.3 93.98,16.76 95.25,16.76 96.52,16.76 97.79,16.76 99.06,16.76 100.33,16.76 101.6,16.76 102.87,16.76 95.25,18.03 96.52,18.03 97.79,18.03 99.06,18.03 100.33,18.03 101.6,18.03 102.87,18.03 78.74,18.03 80.01,18.03 81.28,18.03 82.55,18.03 83.82,18.03 85.09,18.03 86.36,18.03 87.63,18.03 88.9,18.03 90.17,18.03 91.44,18.03 92.71,18.03 93.98,18.03 78.74,16.76 80.01,16.76 81.28,16.76 82.55,16.76 83.82,16.76 85.09,16.76 86.36,16.76 87.63,16.76 88.9,16.76 90.17,16.76 91.44,16.76 92.71,16.76
  pour Top: 77.47,21.34 112.27,21.34 112.27,0.25 77.47,0.25
  pour Bottom: 77.47,21.34 112.27,21.34 112.27,13.46 77.47,13.46
REGOUT  (via drill 0.38)  (2 unrouted)
  Top 0.254: R42.1 R41.1 R40.1 R39.1 R38.1 | R43.1 v54.36,29.92 | U$10.26 47.02,35.56 v46.51,35.05
  Top 0.305: U$1.8 v11.2,35.97 10.41,36.83 8.38,36.83 v7.62,36.07 | Q1.2 77.22,32.51 77.22,33.02 76.71,33.53 v74.93,33.53 74.42,34.04 68.07,34.04 67.56,33.53 65.79,33.53 63.1,30.85 R43.1 | 45.97,39.88 45.97,43.94 46.37,44.34 R42.1 v47.24,45.47 | 45.97,39.88 47.02,38.84 U$10.26 | v27.94,38.86 40.13,38.86 41.15,39.88 45.97,39.88 | v63.5,55.12 66.29,55.12 66.55,55.37
  Bottom 0.254: v46.51,35.05 45.4,35.05 C23.2 | R36.1 46.23,50.55 47.24,49.53 | v54.36,29.92 45.49,29.92 44.96,30.48 44.96,34.48
  Bottom 0.305: R23.1 6.86,35.81 | 6.86,35.81 6.86,37.27 R22.1 | v7.62,36.07 7.11,36.07 6.86,35.81 | v11.2,35.97 15.93,35.97 16.76,36.83 16.76,39.62 17.78,40.64 27.18,40.64 27.94,39.88 v27.94,38.86 | 44.96,34.48 C23.2 | R26.2 74.68,33.27 v74.93,33.53 | v47.24,45.47 47.24,49.53 47.64,49.53 R44.1 51.93,51.56 54.36,51.56 55.63,52.83 55.63,55.12 56.13,55.63 62.99,55.63 v63.5,55.12
REGSRC  (via drill 0.38)
  Top 0.254: U$1.9 v11.68,32
  Bottom 0.254: v11.68,32 C25.2
  Bottom 0.406: R51.2 5.52,30.87 U$27.P$2 6.35,31.24 7.11,30.48 11.62,30.48 C25.2
SCL  (via drill 0.38)  (2 unrouted)
  Top 0.203: v81.28,49.02 81.03,49.28 81.03,51.82 82.3,53.09 85.09,53.09 85.85,52.32 87.38,52.32 87.87,51.83 U$25.8 88.02,51.82 89.41,51.82 90.17,51.05 90.17,45.97 91.3,44.85 R57.1 95.32,45.43 U$20.14
  Bottom 0.203: U$32.P$2 81.66,50 81.66,49.4 v81.28,49.02 81.02,49.28 U$34.11
SCL_  (via drill 0.38)
  Top 0.254: U$10.4 46.51,28.73 45.97,28.19 45.97,26.42 v46.08,26.19 | v2.03,26.42 2.03,33.27 2.29,33.53 v4.32,33.53
  Top 0.305: U$1.5 9.68,35.79 v9.65,36.07
  Bottom 0.254: R22.2 4.83,37.34 4.83,34.04 v4.32,33.53 | v46.08,26.19 45.9,25.88 45.24,25.88 35.56,25.91 35.31,26.16 16.76,26.16 15.49,24.89 11.68,24.89 9.4,22.61 3.05,22.61 2.03,23.62 v2.03,26.42
  Bottom 0.305: v9.65,36.07 9.65,38.35 9.4,38.61 5.08,38.61 4.83,38.35 4.83,37.4 R22.2
SDA  (via drill 0.38)  (2 unrouted)
  Top 0.203: U$20.15 96.81,44.63 R58.1 95.65,44.34 95.5,44.2 90.93,44.2 | 90.93,44.2 89.41,45.72 89.41,49.78 88.9,50.29 87.98,50.29 U$25.7 | 90.93,44.2 90.93,43.69 90.68,43.43 81.28,43.43 80.01,44.7 v80.01,48.01
  Bottom 0.203: U$34.12 80.48,48.78 80.76,48.5 | 80.76,48.5 U$32.P$10 | v80.01,48.01 80.26,48.01 80.76,48.5
SDA_  (via drill 0.38)
  Top 0.254: U$10.3 46.03,29.01 45.21,28.19 45.21,26.92 v45.19,26.67 | v8.64,35.81 9.14,35.31 9.14,34.29 9.17,34.27 U$1.4 9.17,34.06 9.14,34.04 9.14,32.77
  Top 0.305: v9.4,32.51 9.14,32.77
  Bottom 0.254: v45.19,26.67 44.2,26.67 44.2,27.69 43.43,28.45 28.19,28.45 27.43,29.21 18.29,29.21 17.27,30.23 17.27,32.77 16.26,33.78 9.14,33.78 8.64,34.29 v8.64,35.81
  Bottom 0.305: R23.2 9.08,32.58 v9.4,32.51
SENSOR_POWER  (via drill 0.38)  (1 unrouted)
  Top 0.203: v78.74,50.04 v78.74,47.24 73.66,47.24 72.9,46.48 v72.9,45.21 | v81.79,44.2 85.85,44.2 86.87,45.21 v86.87,46.48
  Top 0.254: C43.1 84.24,50.46 84.84,51.05 84.84,51.56 85.77,51.56 U$25.1 85.96,51.56 86.61,51.56 86.87,51.31 86.87,48.26 86.74,48.13 86.52,47.91 U$25.4
  Top 0.305: 85.09,54.86 v86.61,53.34 | v86.87,46.48 86.87,48.01 86.74,48.13
  Bottom 0.203: C42.2 68.33,44.7 69.09,43.94 73.52,43.94 C36.1 | U$32.P$8 82.04,47.24 | 82.04,47.24 82.04,46.62 C39.1 | v78.74,47.24 80.77,47.24 | 80.77,47.24 82.04,47.24 | C38.1 C33.1 81.17,50.1 U$32.P$1 78.98,50.02 v78.74,50.04 | C35.1 73.66,45.97 v72.9,45.21 | 80.77,47.24 80.77,45.21 v81.79,44.2
  Bottom 0.254: U$34.17 U$34.18 | U$34.18 71.37,48.25 71.37,49.02 71.63,49.28 72.39,49.28 72.64,49.03 U$34.15 72.64,46.74 73.41,45.97 C35.1 73.77,44.7 C36.1 | C37.1 70.75,46.62 71.37,47.24 71.37,47.77 U$34.18
  Bottom 0.305: v86.61,53.34 86.61,46.74 v86.87,46.48
SMBC  (via drill 0.38)  (1 unrouted)
  Top 0.406: U$19.P$2 95,28.45 95.76,29.21 96.52,29.21 99.57,32.26 99.57,35.81 v100.08,36.32 | v97.54,36.32 R47.2
  Bottom 0.406: v100.08,36.32 v97.54,36.32
SMBD  (via drill 0.38)  (1 unrouted)
  Top 0.406: R48.2 96.2,33.72 v95,32.51 | v92.96,29.21 U$18.P$2
  Bottom 0.406: v95,32.51 95,29.97 94.49,29.46 93.22,29.46 v92.96,29.21
VC5X  (via drill 0.38)  (3 unrouted)
  Top 0.254: v12.19,37.08 12.19,34.19 U$1.10 12.17,32.86 R20.2 13.46,31.43 13.46,30.48 13.97,29.97 v14.48,29.97 | 22.16,46.92 22.16,45.28 v20.57,43.69
  Top 0.305: R16.1 15.31,29.14 v14.48,29.97
  Top 0.406: C8.1 22.16,49.4 C13.2 22.16,46.92 22.35,46.74
  Bottom 0.254: U$2.P$2 v12.19,37.08 12.19,41.15 14.73,43.69 v20.57,43.69 | C19.1 14.29,30.16 v14.48,29.97
VC10X  (2 unrouted)
  Top 0.254: U$9.P$2 16,35.48 U$1.15

### Text on the board
tPlace: AUX POWER | ~10-Cell Battery Management System v1.0~ | 0 | 1 | 2 | 3 | 4 | 5 | 6 | 7 | 8 | 9 | EXT POWER | 10 | BMS POWER | LEDS | RESET | BOOT | ESC PULSE | BATT- | DISCHARGE- | DANGER HIGH VOLTAGE | BATT+ | DISCHARGE+ | DANGER HIGH VOLTAGE